# EAGLE schematic usbl (EAGLE 5.11)
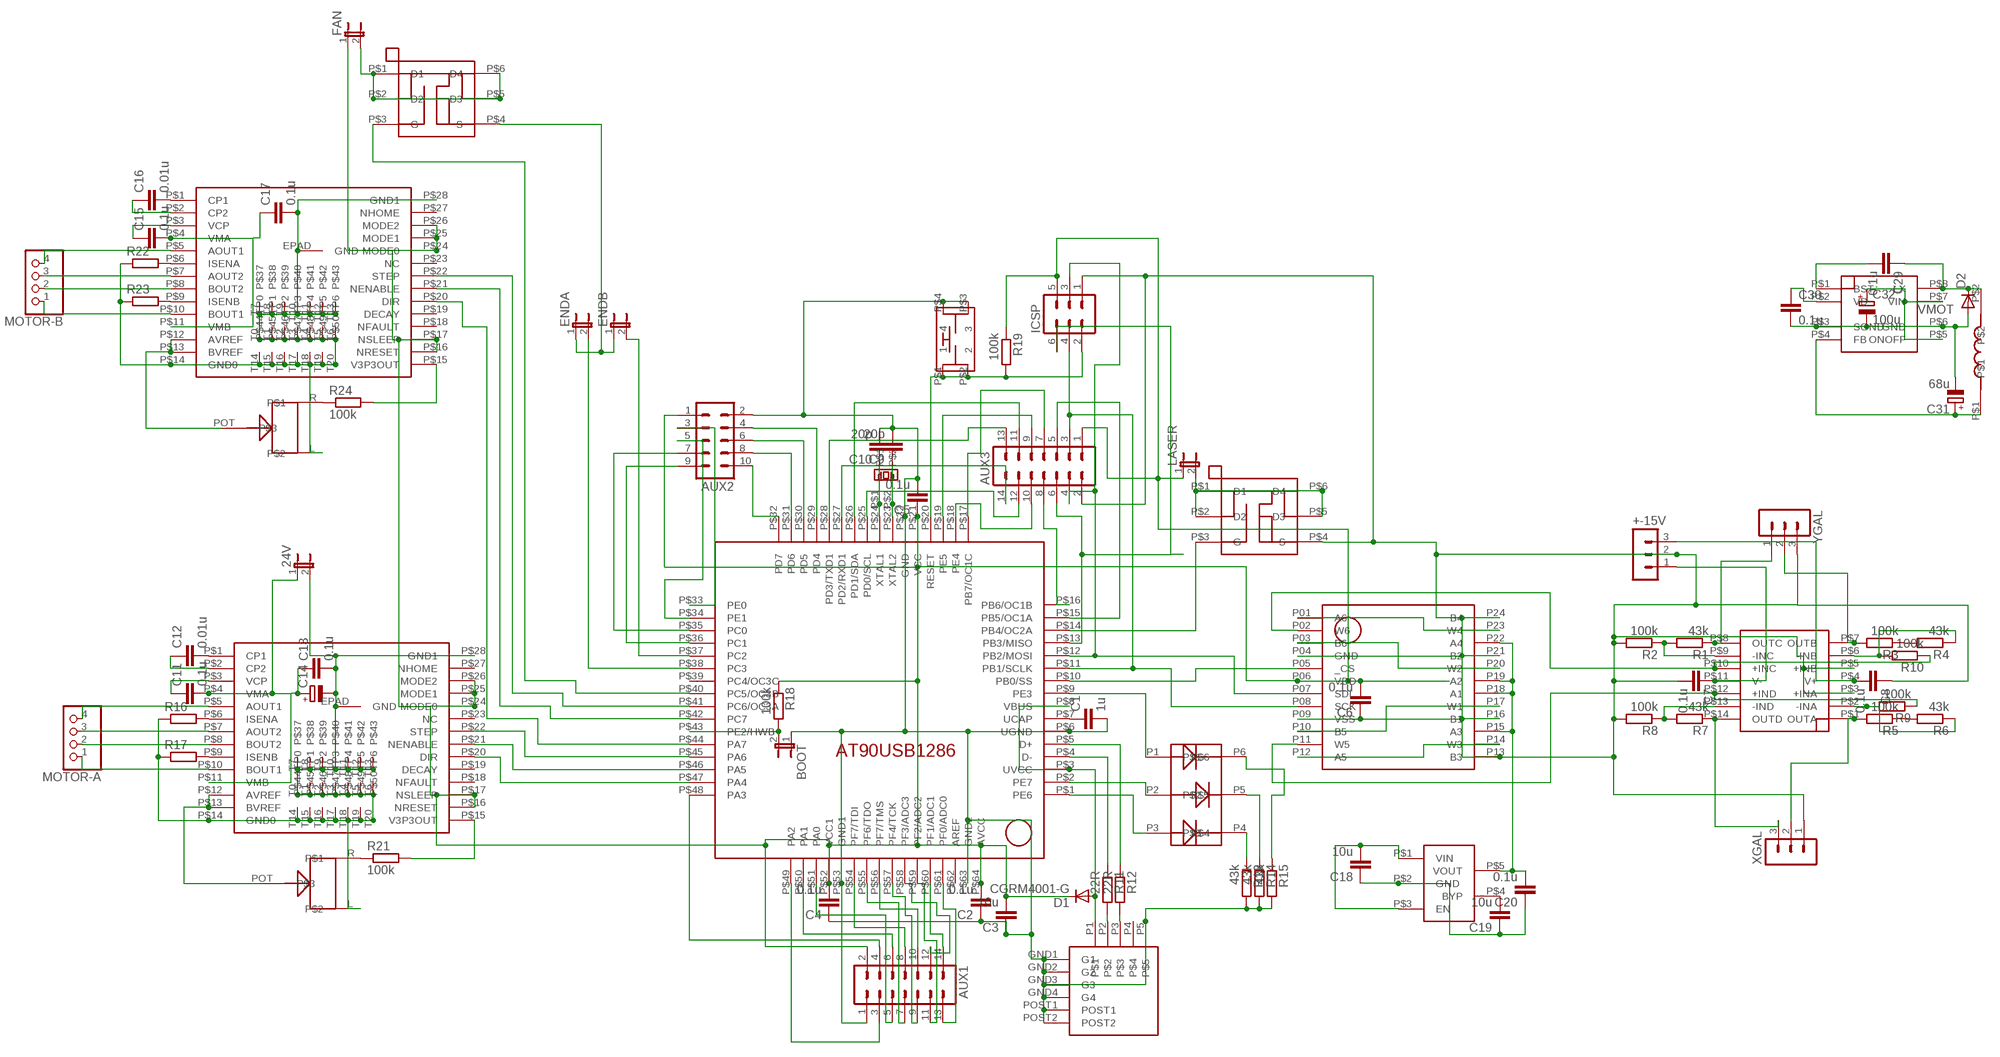
[diagram p0: schematic, sheet 1]

## Parts
24V  JP1E  [JP1]
+-15V  MA03-1  [MA03-1]
AUX1  MA07-2  [MA07-2]
AUX2  MA05-2  [MA05-2]
AUX3  MA07-2  [MA07-2]
BOOT  JP1E  [JP1]
C1  1u  C-EUC0603K  [C0603K]
C2  0.1u  C-EUC0603K  [C0603K]
C3  10u  C-EUC0603K  [C0603K]
C4  0.1u  C-EUC0603K  [C0603K]
C5  0.1u  C-EUC0603K  [C0603K]
C6  0.1u  C-EUC0603K  [C0603K]
C7  0.1u  C-EUC0603K  [C0603K]
C8  0.1u  C-EUC0603K  [C0603K]
C9  20p  C-EUC0603K  [C0603K]
C10  20p  C-EUC0603K  [C0603K]
C11  0.1u  C-EUC0603  [C0603]
C12  0.01u  C-EUC0603  [C0603]
C13  0.1u  C-EUC0603  [C0603]
C14  CPOL-EUD  [PANASONIC_D]
C15  0.1u  C-EUC0603  [C0603]
C16  0.01u  C-EUC0603  [C0603]
C17  0.1u  C-EUC0603  [C0603]
C18  10u  C-EUC0603K  [C0603K]
C19  10u  C-EUC0603K  [C0603K]
C20  0.1u  C-EUC0603K  [C0603K]
C29  0.1u  C-EUC0603K  [C0603K]
C30  0.1u  C-EUC0603K  [C0603K]
C31  68u  CPOL-EUD/7343-31R  [D/7343-31R]
C32  100u  CPOL-EUD  [PANASONIC_D]
D1  CGRM4001-G  [SOD-123_MINI-SMA]
D2  DIODE-DO214AA  [DO214AA]
ENDA  JP1E  [JP1]
ENDB  JP1E  [JP1]
FAN  JP1E  [JP1]
ICSP  MA03-2  [MA03-2]
LASER  JP1E  [JP1]
MOTOR-A  PINHD-1X4  [1X04]
MOTOR-B  PINHD-1X4  [1X04]
R1  43k  R-EU_R0603  [R0603]
R2  100k  R-EU_R0603  [R0603]
R3  100k  R-EU_R0603  [R0603]
R4  43k  R-EU_R0603  [R0603]
R5  100k  R-EU_R0603  [R0603]
R6  43k  R-EU_R0603  [R0603]
R7  43k  R-EU_R0603  [R0603]
R8  100k  R-EU_R0603  [R0603]
R9  100k  R-EU_R0603  [R0603]
R10  100k  R-EU_R0603  [R0603]
R11  22R  R-EU_R0603  [R0603]
R12  22R  R-EU_R0603  [R0603]
R13  43k  R-EU_R0603  [R0603]
R14  43k  R-EU_R0603  [R0603]
R15  43k  R-EU_R0603  [R0603]
R16  R-EU_R0805  [R0805]
R17  R-EU_R0805  [R0805]
R18  100k  R-EU_R0603  [R0603]
R19  100k  R-EU_R0603  [R0603]
R21  100k  R-EU_R0603  [R0603]
R22  R-EU_R0805  [R0805]
R23  R-EU_R0805  [R0805]
R24  100k  R-EU_R0603  [R0603]
U$1  AT90USB1286  [TQFP64]
U$2  AD5206  [TSSOP24]
U$3  OPA4171  [TSSOP14]
U$4  TXC7A  [TXC7A]
U$5  MICROUSB  [MICROUSB]
U$6  OMRONLED  [OMRONLED]
U$7  DRV8825  [ETSSOP28]
U$8  POT22A  [POT22A]
U$9  BSD816SN  [SOT363]
U$10  TL3315  [4PSWITCH]
U$11  DRV8825  [ETSSOP28]
U$12  POT22A  [POT22A]
U$13  BSD816SN  [SOT363]
U$14  CAT6219  [TSOT23]
U$40  MAX5035  [SO8]
U$41  100uH  INDUCTOR  [INDUCTOR]
XGAL  MA03-1  [MA03-1]
YGAL  MA03-1  [MA03-1]

## Nets
+15: +-15V.3 C8.2 U$3.P$4(V+)
GND: 24V.2 +-15V.2 AUX1.1 AUX2.2 AUX3.2 BOOT.1 C1.2 C2.1 C3.1 C4.1 C5.2 C6.1 C7.2 C8.1 C9.2 C10.2 C13.2 C14.- C17.2 C18.1 C19.1 C20.1 C30.2 C31.- C32.- D2.A ENDA.1 ENDB.1 ICSP.1 R2.2 R8.2 R13.2 R14.2 R15.2 R16.1 R17.1 R22.1 R23.1 U$1.P$6(UGND) U$1.P$22(GND) U$1.P$53(GND1) U$1.P$63(GND2) U$2.P04(GND) U$2.P09(VSS) U$2.P13(B3) U$2.P16(B1) U$2.P21(B2) U$2.P24(B4) U$3.P$3(+INA) U$3.P$5(+INB) U$5.GND1(G1) U$5.GND2(G2) U$5.GND3(G3) U$5.GND4(G4) U$5.P5 U$5.POST1 U$5.POST2 U$7.EPAD(GND) U$7.P$14(GND0) U$7.P$28(GND1) U$7.T0(TP0) U$7.T1(TP1) U$7.T2(TP2) U$7.T3(TP3) U$7.T4(TP4) U$7.T5(TP5) U$7.T6(TP6) U$7.T7 U$7.T8 U$7.T9 U$7.T10 U$7.T11 U$7.T12 U$7.T13 U$7.T14 U$7.T15 U$7.T16 U$7.T17 U$7.T18 U$7.T19 U$7.T20 U$8.L U$9.P$4(S) U$10.P$3 U$10.P$4 U$11.EPAD(GND) U$11.P$14(GND0) U$11.P$28(GND1) U$11.T0(TP0) U$11.T1(TP1) U$11.T2(TP2) U$11.T3(TP3) U$11.T4(TP4) U$11.T5(TP5) U$11.T6(TP6) U$11.T7 U$11.T8 U$11.T9 U$11.T10 U$11.T11 U$11.T12 U$11.T13 U$11.T14 U$11.T15 U$11.T16 U$11.T17 U$11.T18 U$11.T19 U$11.T20 U$12.L U$13.P$4(S) U$14.P$2(GND) U$40.P$3(SGND) U$40.P$6(GND) XGAL.1 YGAL.3
N$1: U$2.P10(B5) U$2.P17(W1)
N$2: U$2.P12(A5) U$2.P14(W3)
N$3: C20.2 U$2.P15(A3) U$2.P18(A1) U$2.P19(A2) U$2.P22(A4) U$14.P$5(VOUT)
N$4: R11.1 U$1.P$4(D-)
N$5: U$2.P03(B6) U$2.P20(W2)
N$6: U$2.P01(A6) U$2.P23(W4)
N$7: R4.1 R10.2 U$3.P$6(-INB)
N$8: R9.1 U$2.P11(W5) U$3.P$12(+IND)
N$9: R12.1 U$1.P$5(D+)
N$10: U$1.P$10(PB0/SS) U$2.P05(_CS)
N$11: AUX3.4 ICSP.3 U$1.P$12(PB2/MOSI) U$2.P07(SDI)
N$12: AUX3.3 ICSP.4 U$1.P$11(PB1/SCLK) U$2.P08(SCK)
N$13: R1.1 U$3.P$8(OUTC) YGAL.1
N$14: R1.2 R2.1 U$3.P$9(-INC)
N$15: R3.2 U$3.P$7(OUTB) YGAL.2
N$16: R3.1 R4.2
N$17: R5.2 U$3.P$1(OUTA) XGAL.2
N$18: R5.1 R6.2
N$19: R7.1 U$3.P$14(OUTD) XGAL.3
N$20: R7.2 R8.1 U$3.P$13(-IND)
N$21: R6.1 R9.2 U$3.P$2(-INA)
N$22: R11.2 U$5.P2
N$23: R12.2 U$5.P3
N$24: D1.A U$1.P$3(UVCC) U$1.P$8(VBUS) U$5.P1
N$25: R10.1 U$2.P02(W6) U$3.P$10(+INC)
N$26: U$11.P$12(AVREF) U$11.P$13(BVREF) U$12.POT
N$27: C1.1 U$1.P$7(UCAP)
N$28: U$1.P$9(PE3) U$6.P1
N$29: U$1.P$2(PE7) U$6.P2
N$30: U$1.P$1(PE6) U$6.P3
N$31: R13.1 U$6.P4
N$32: +-15V.1 C7.1 U$3.P$11(V-)
N$33: R21.2 U$7.P$15(V3P3OUT)
N$34: R14.1 U$6.P5
N$35: R15.1 U$6.P6
N$36: AUX1.13 U$1.P$61(PF0/ADC0)
N$37: C9.1 U$1.P$23(XTAL2) U$4.P$2
N$38: C10.1 U$1.P$24(XTAL1) U$4.P$1
N$39: AUX1.14 U$1.P$60(PF1/ADC1)
N$40: AUX1.11 U$1.P$59(PF2/ADC2)
N$41: AUX1.12 U$1.P$58(PF3/ADC3)
N$42: AUX1.10 U$1.P$56(PF7/TMS)
N$43: AUX1.9 U$1.P$57(PF4/TCK)
N$44: AUX1.7 U$1.P$55(PF6/TDO)
N$45: AUX1.8 U$1.P$54(PF7/TDI)
N$46: AUX1.5 U$1.P$51(PA0)
N$47: AUX1.6 U$1.P$50(PA1)
N$48: AUX1.3 U$1.P$49(PA2)
N$49: AUX1.4 U$1.P$48(PA3)
N$50: C12.2 U$7.P$1(CP1)
N$51: C12.1 U$7.P$2(CP2)
N$52: U$7.P$12(AVREF) U$7.P$13(BVREF) U$8.POT
N$53: MOTOR-A.3 U$7.P$7(AOUT2)
N$54: U$1.P$47(PA4) U$7.P$20(DIR)
N$55: U$1.P$46(PA5) U$7.P$21(NENABLE)
N$56: U$1.P$45(PA6) U$7.P$22(STEP)
N$57: R16.2 U$7.P$6(ISENA)
N$58: R17.2 U$7.P$9(ISENB)
N$59: C11.1 U$7.P$3(VCP)
N$60: R21.1 U$8.R
N$61: MOTOR-A.2 U$7.P$8(BOUT2)
N$62: MOTOR-A.4 U$7.P$5(AOUT1)
N$63: MOTOR-A.1 U$7.P$10(BOUT1)
N$64: U$1.P$44(PA7) U$11.P$20(DIR)
N$65: U$1.P$42(PC7) U$11.P$21(NENABLE)
N$66: U$1.P$41(PC6/OC3A) U$11.P$22(STEP)
N$67: R22.2 U$11.P$6(ISENA)
N$68: R23.2 U$11.P$9(ISENB)
N$69: C16.2 U$11.P$1(CP1)
N$70: C16.1 U$11.P$2(CP2)
N$71: C15.1 U$11.P$3(VCP)
N$72: MOTOR-B.3 U$11.P$7(AOUT2)
N$73: MOTOR-B.2 U$11.P$8(BOUT2)
N$74: MOTOR-B.4 U$11.P$5(AOUT1)
N$75: MOTOR-B.1 U$11.P$10(BOUT1)
N$76: R24.2 U$11.P$15(V3P3OUT)
N$77: R24.1 U$12.R
N$78: U$1.P$40(PC5/OC3B) U$13.P$3(G)
N$79: FAN.2 U$13.P$1(D1) U$13.P$2(D2) U$13.P$5(D3) U$13.P$6(D4)
N$80: BOOT.2 R18.2 U$1.P$43(PE2/HWB)
N$81: ENDB.2 U$1.P$37(PC2)
N$82: AUX2.10 U$1.P$32(PD7)
N$83: LASER.2 U$9.P$1(D1) U$9.P$2(D2) U$9.P$5(D3) U$9.P$6(D4)
N$84: U$1.P$14(PB4/OC2A) U$9.P$3(G)
N$85: AUX2.8 U$1.P$31(PD6)
N$86: AUX2.6 U$1.P$30(PD5)
N$87: AUX2.4 U$1.P$29(PD4)
N$88: AUX2.9 U$1.P$36(PC1)
N$89: AUX2.7 U$1.P$35(PC0)
N$90: AUX2.5 U$1.P$34(PE1)
N$91: AUX2.3 U$1.P$33(PE0)
N$92: AUX3.13 U$1.P$28(PD3/TXD1)
N$93: AUX3.14 U$1.P$27(PD2/RXD1)
N$94: AUX3.11 U$1.P$26(PD1/SDA)
N$95: AUX3.12 U$1.P$25(PD0/SCL)
N$96: AUX3.9 U$1.P$19(PE5)
N$97: AUX3.10 U$1.P$18(PE4)
N$98: AUX3.7 U$1.P$17(PB7/OC1C)
N$99: AUX3.8 U$1.P$16(PB6/OC1B)
N$100: AUX3.5 U$1.P$15(PB5/OC1A)
N$101: AUX3.6 ICSP.6 U$1.P$13(PB3/MISO)
N$102: ENDA.2 U$1.P$38(PC3)
N$103: ICSP.2 R19.2 U$1.P$20(RESET) U$10.P$1 U$10.P$2
N$104: C29.2 U$40.P$1(BST)
N$105: C29.1 D2.C U$40.P$8(LX) U$41.P$2
N$106: C30.1 U$40.P$2(VD)
N$110: C19.2 U$14.P$4(BYP)
VCC: AUX1.2 AUX2.1 AUX3.1 C2.2 C3.2 C4.2 C5.1 C6.2 C18.2 C31.+ D1.C FAN.1 ICSP.5 LASER.1 R18.1 R19.1 U$1.P$21(VCC) U$1.P$52(VCC1) U$1.P$64(AVCC) U$2.P06(VDD) U$7.P$16(NRESET) U$7.P$17(NSLEEP) U$7.P$24(MODE0) U$7.P$25(MODE1) U$7.P$26(MODE2) U$11.P$16(NRESET) U$11.P$17(NSLEEP) U$11.P$24(MODE0) U$11.P$25(MODE1) U$11.P$26(MODE2) U$14.P$1(VIN) U$14.P$3(EN) U$40.P$4(FB) U$41.P$1
VMOT: 24V.1 C11.2 C13.1 C14.+ C15.2 C17.1 C32.+ U$7.P$4(VMA) U$7.P$11(VMB) U$11.P$4(VMA) U$11.P$11(VMB) U$40.P$5(ONOFF) U$40.P$7(VIN)
Unconnected: U$1.P$39(PC4/OC3C) U$1.P$62(AREF) U$5.P4 U$7.P$18(NFAULT) U$7.P$19(DECAY) U$7.P$23(NC) U$7.P$27(NHOME) U$11.P$18(NFAULT) U$11.P$19(DECAY) U$11.P$23(NC) U$11.P$27(NHOME)

## Library data of the parts
24V BOOT ENDA ENDB FAN LASER = jumper:JP1E: JUMPER
+-15V XGAL YGAL = con-lstb:MA03-1: PIN HEADER; OC_FARNELL: unknown; OC_NEWARK: unknown
AUX1 AUX3 = con-lstb:MA07-2: PIN HEADER; OC_FARNELL: unknown; OC_NEWARK: unknown
AUX2 = con-lstb:MA05-2: PIN HEADER; OC_FARNELL: unknown; OC_NEWARK: unknown
C1-C13 C15-C20 C29 C30 = rcl:C-EU: CAPACITOR, European symbol
C14 C31 C32 = rcl:CPOL-EU: POLARIZED CAPACITOR, European symbol
D1 = diode:CGRM400*-G: Molded plasitc,JEDEC SOD-123/Mini SMA Source: Comchip CGRM4001-G.pdf
D2 = diode:DIODE-: DIODE
ICSP = con-lstb:MA03-2: PIN HEADER; OC_FARNELL: unknown; OC_NEWARK: unknown
MOTOR-A MOTOR-B = RepRapjr:PINHD-1X4: PIN HEADER
R1-R19 R21-R24 = rcl:R-EU_: RESISTOR, European symbol
U$1 = untitled:AT90USB1286
U$2 = untitled:AD5206
U$3 = untitled:OPA4171
U$4 = untitled:TXC7A
U$5 = untitled:MICROUSB
U$6 = untitled:OMRONLED
U$7 U$11 = untitled:DRV8825
U$8 U$12 = untitled:POT22A
U$9 U$13 = untitled:BSD816SN
U$10 = untitled:TL3315
U$14 = untitled:CAT6219
U$40 = untitled:MAX5035
U$41 = untitled:INDUCTOR